# Altium schematic sheet ESP32_Korvo2.SchDoc
size D; SheetNumber: 3; SheetTotal: 3
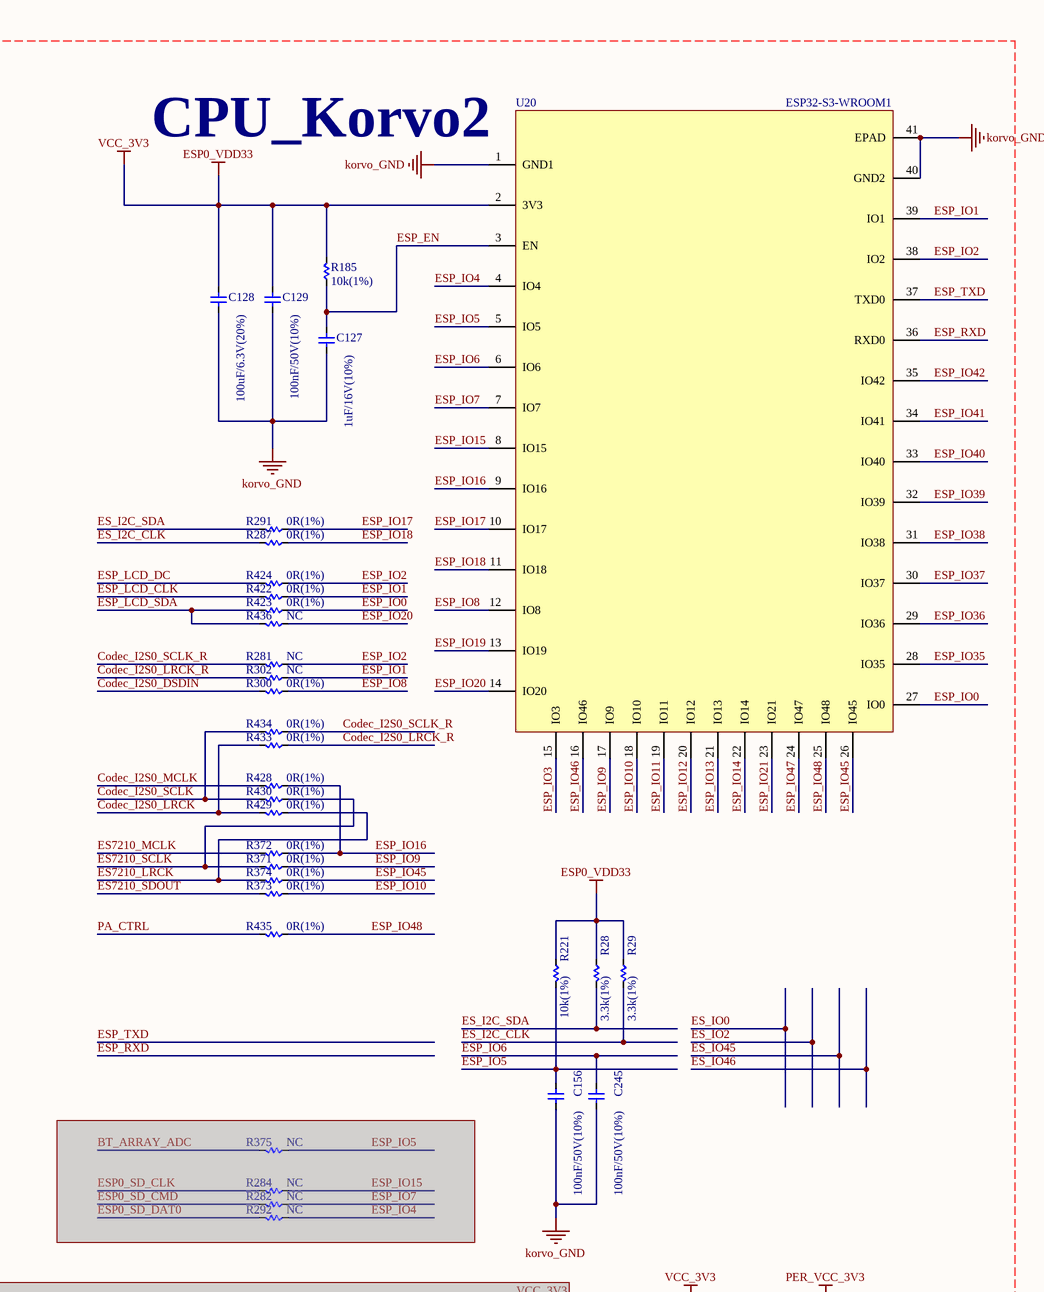
[diagram p0: ESP32_Korvo2.SchDoc, top left]
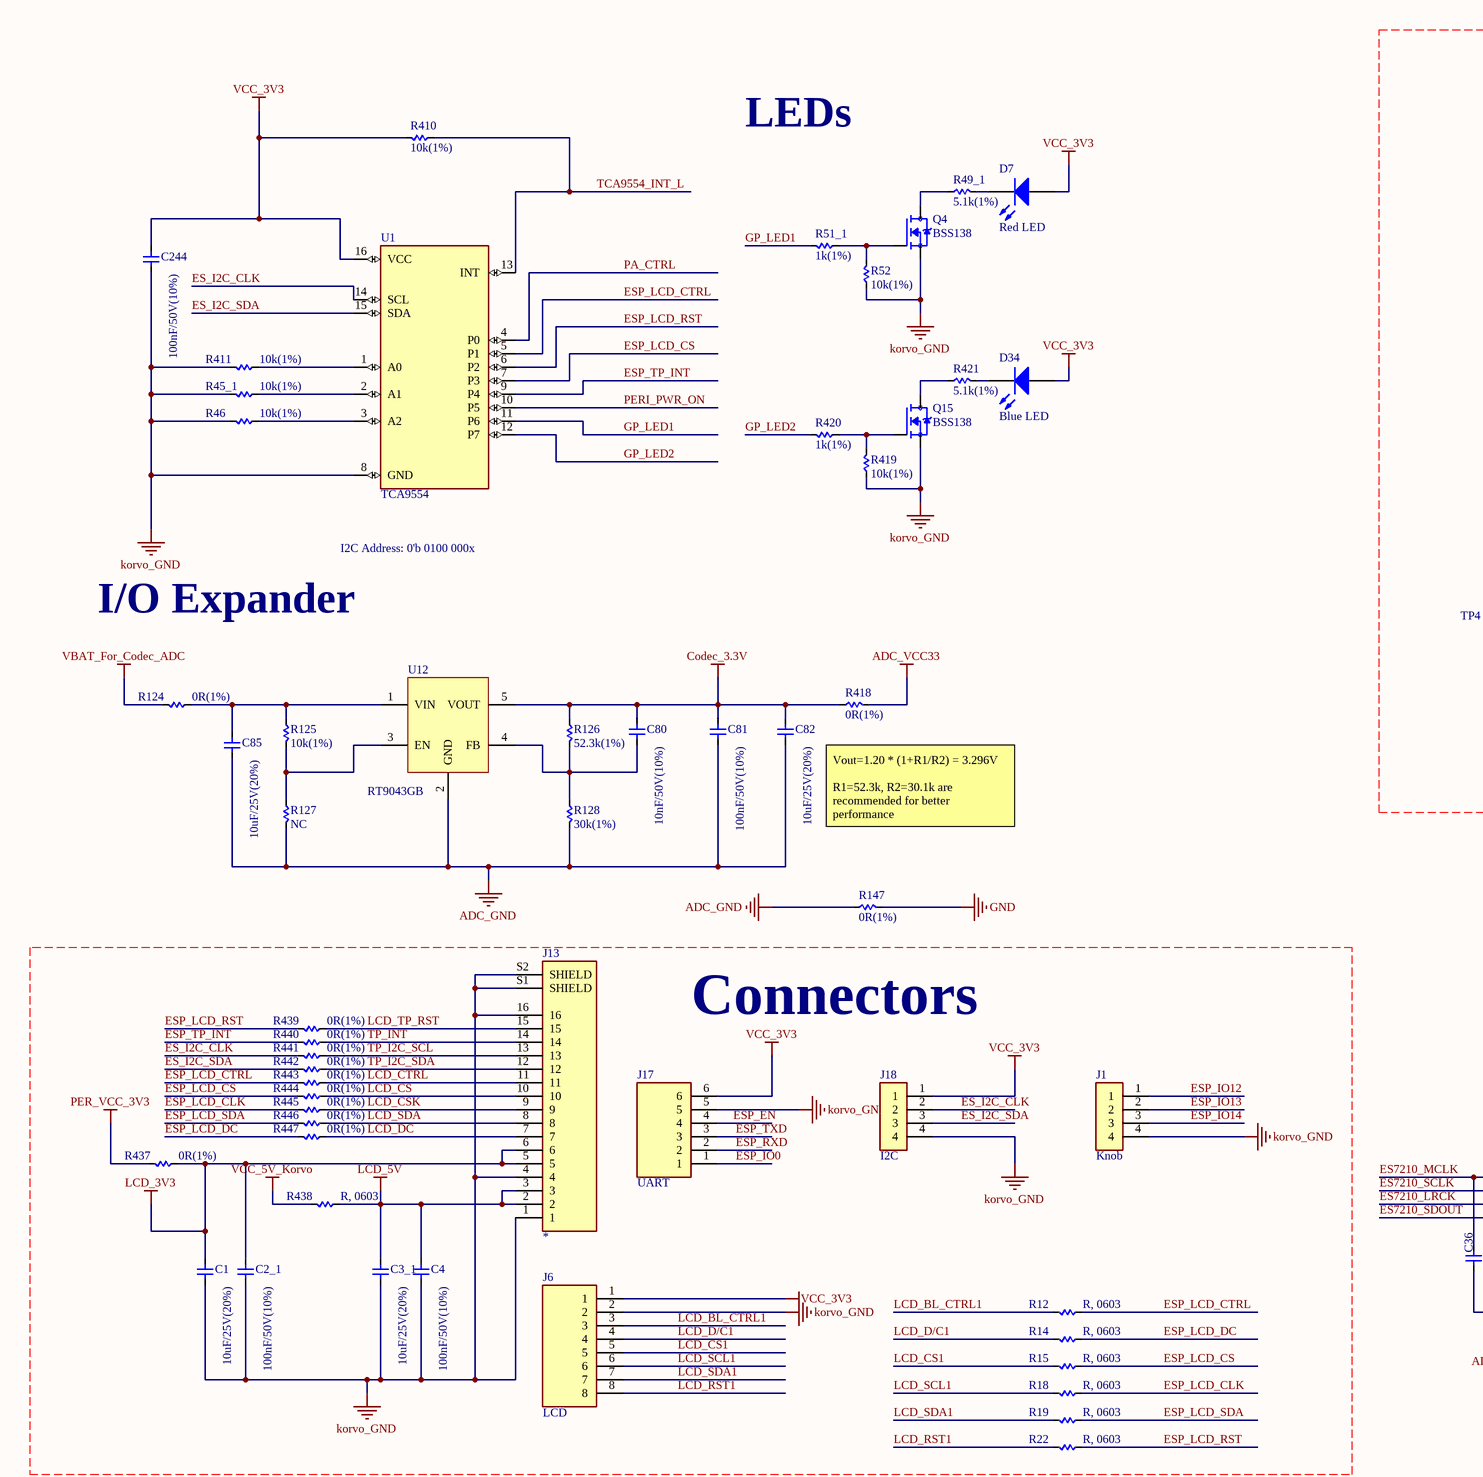
[diagram p1: ESP32_Korvo2.SchDoc, top middle]
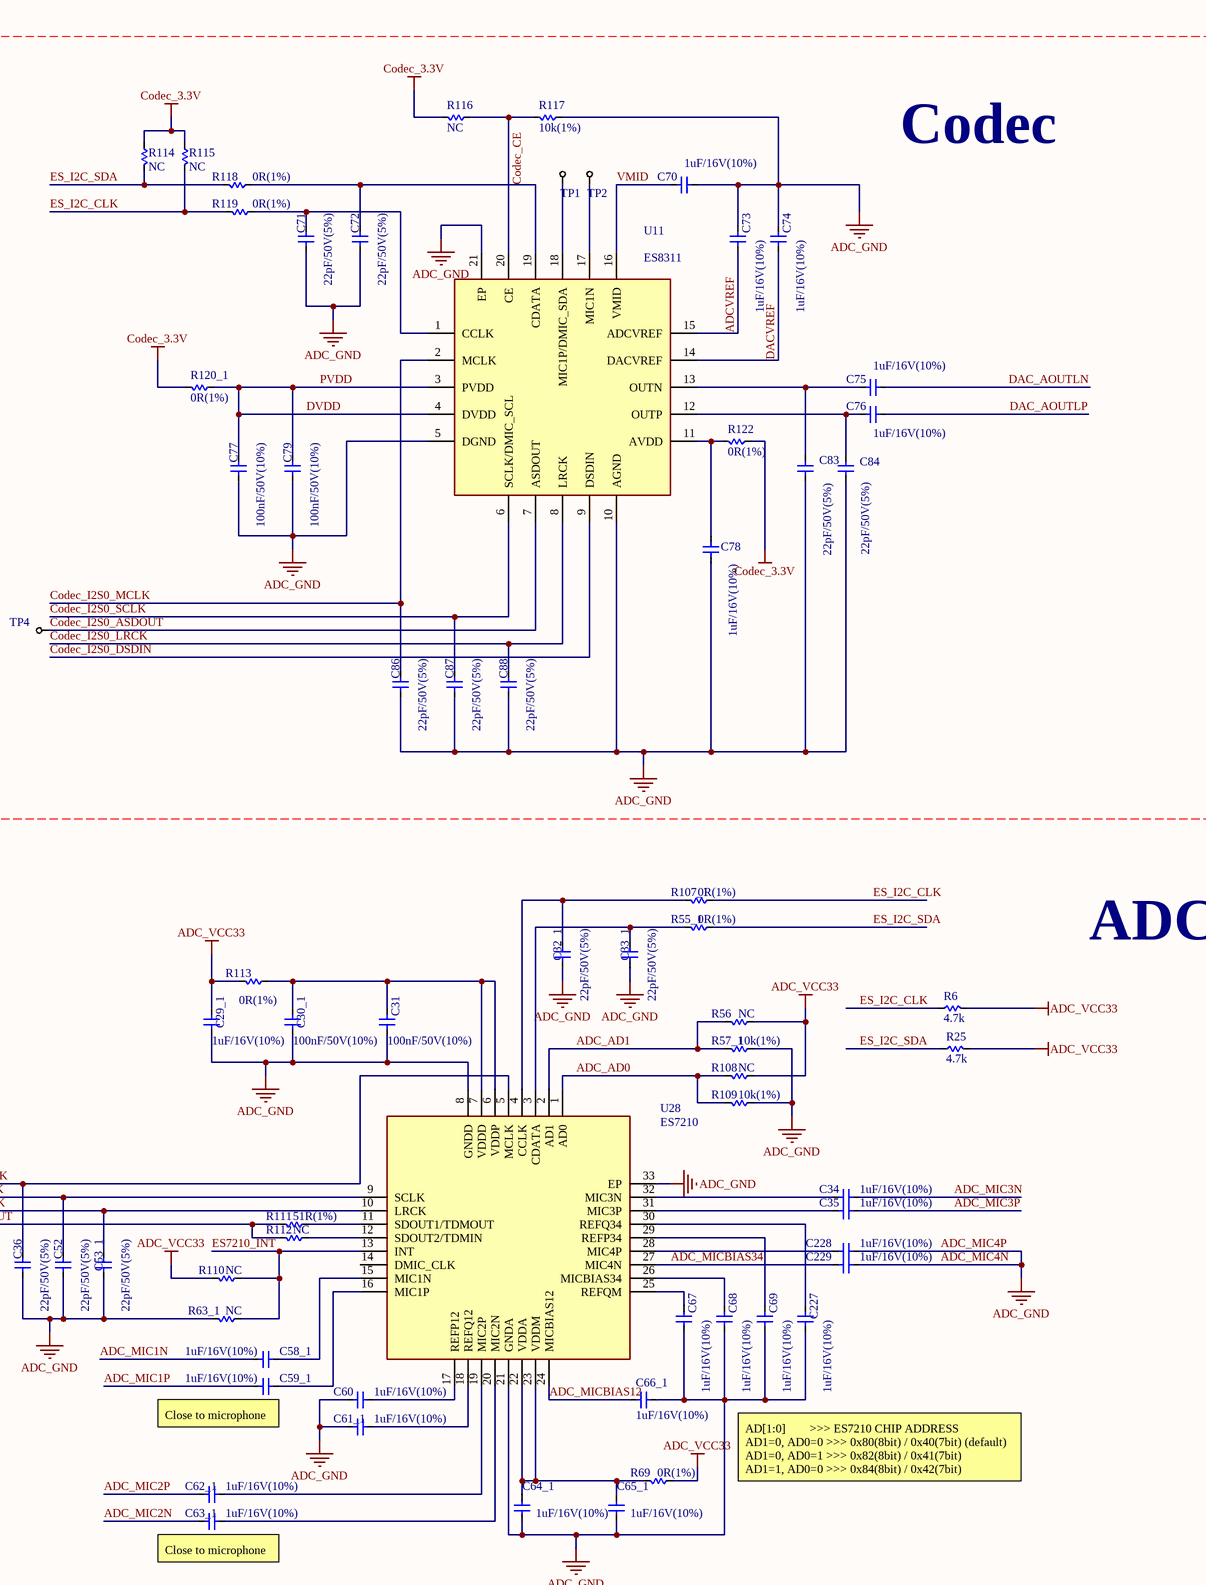
[diagram p2: ESP32_Korvo2.SchDoc, top right]
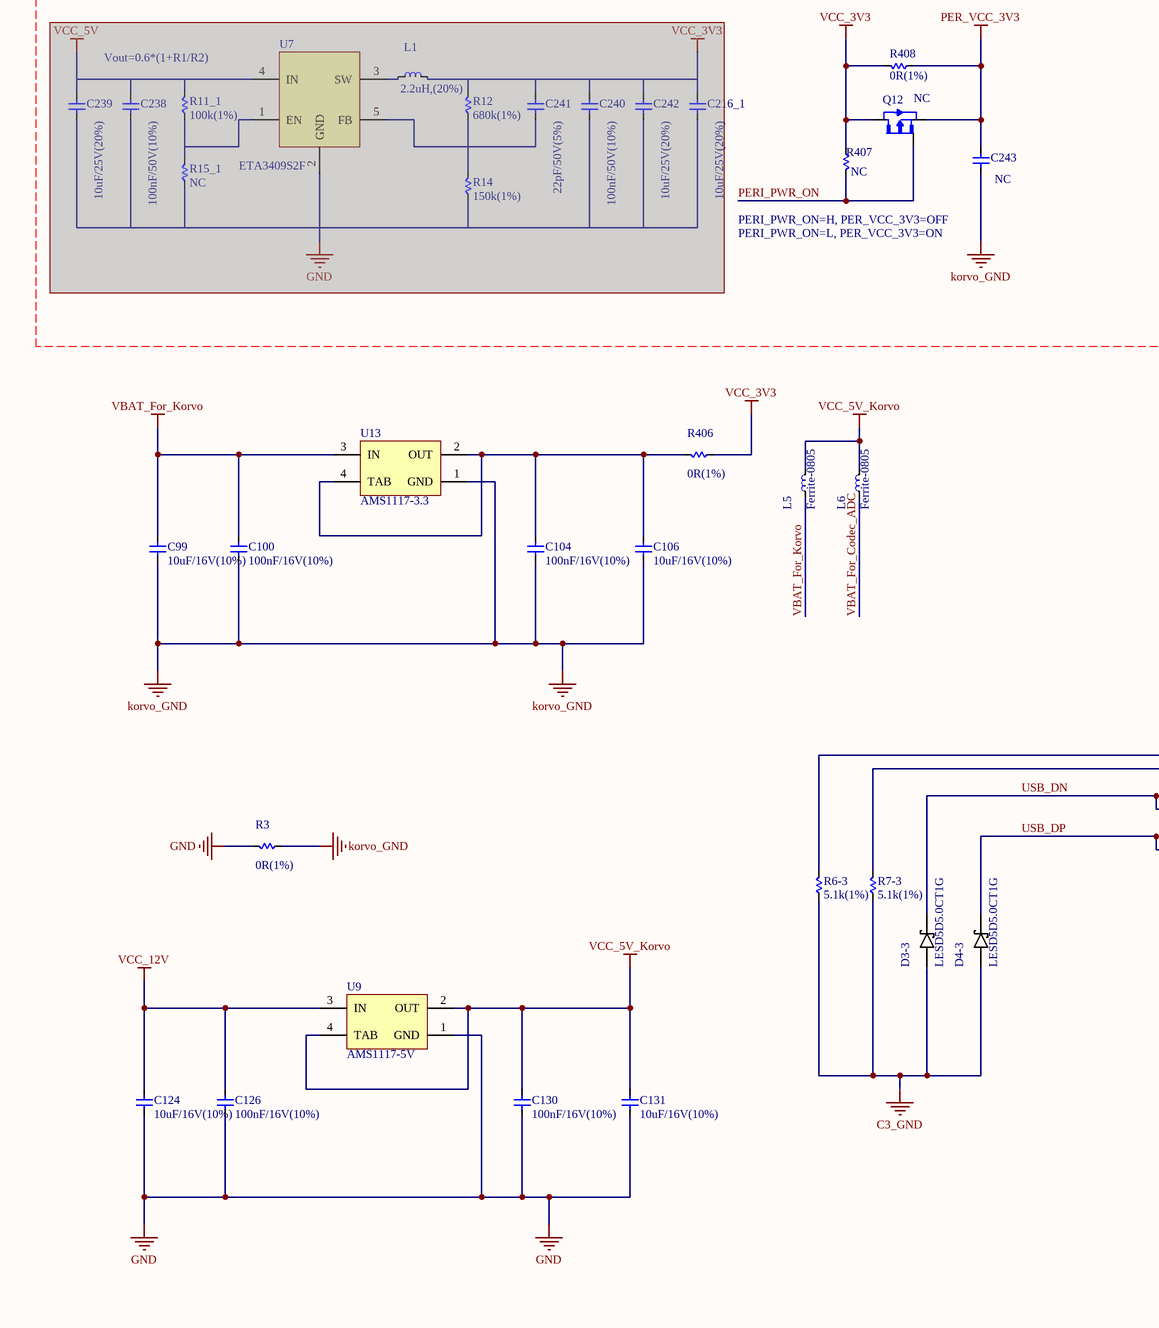
[diagram p3: ESP32_Korvo2.SchDoc, bottom left]
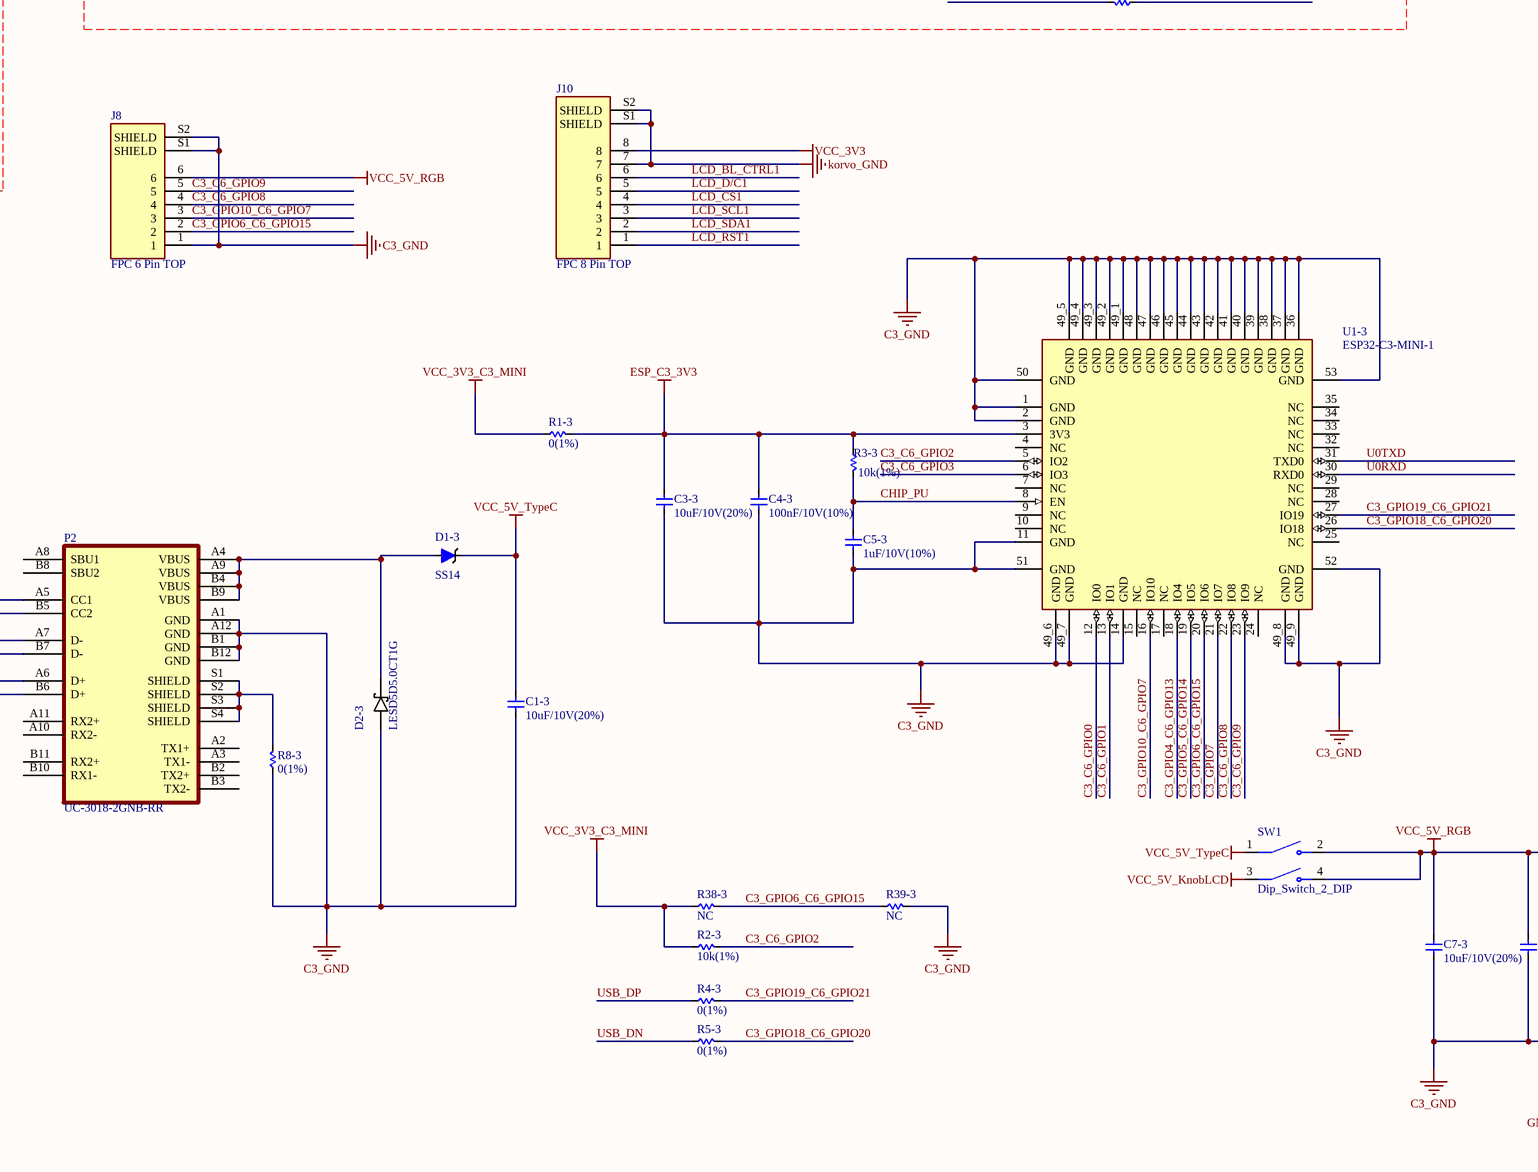
[diagram p4: ESP32_Korvo2.SchDoc, bottom middle]
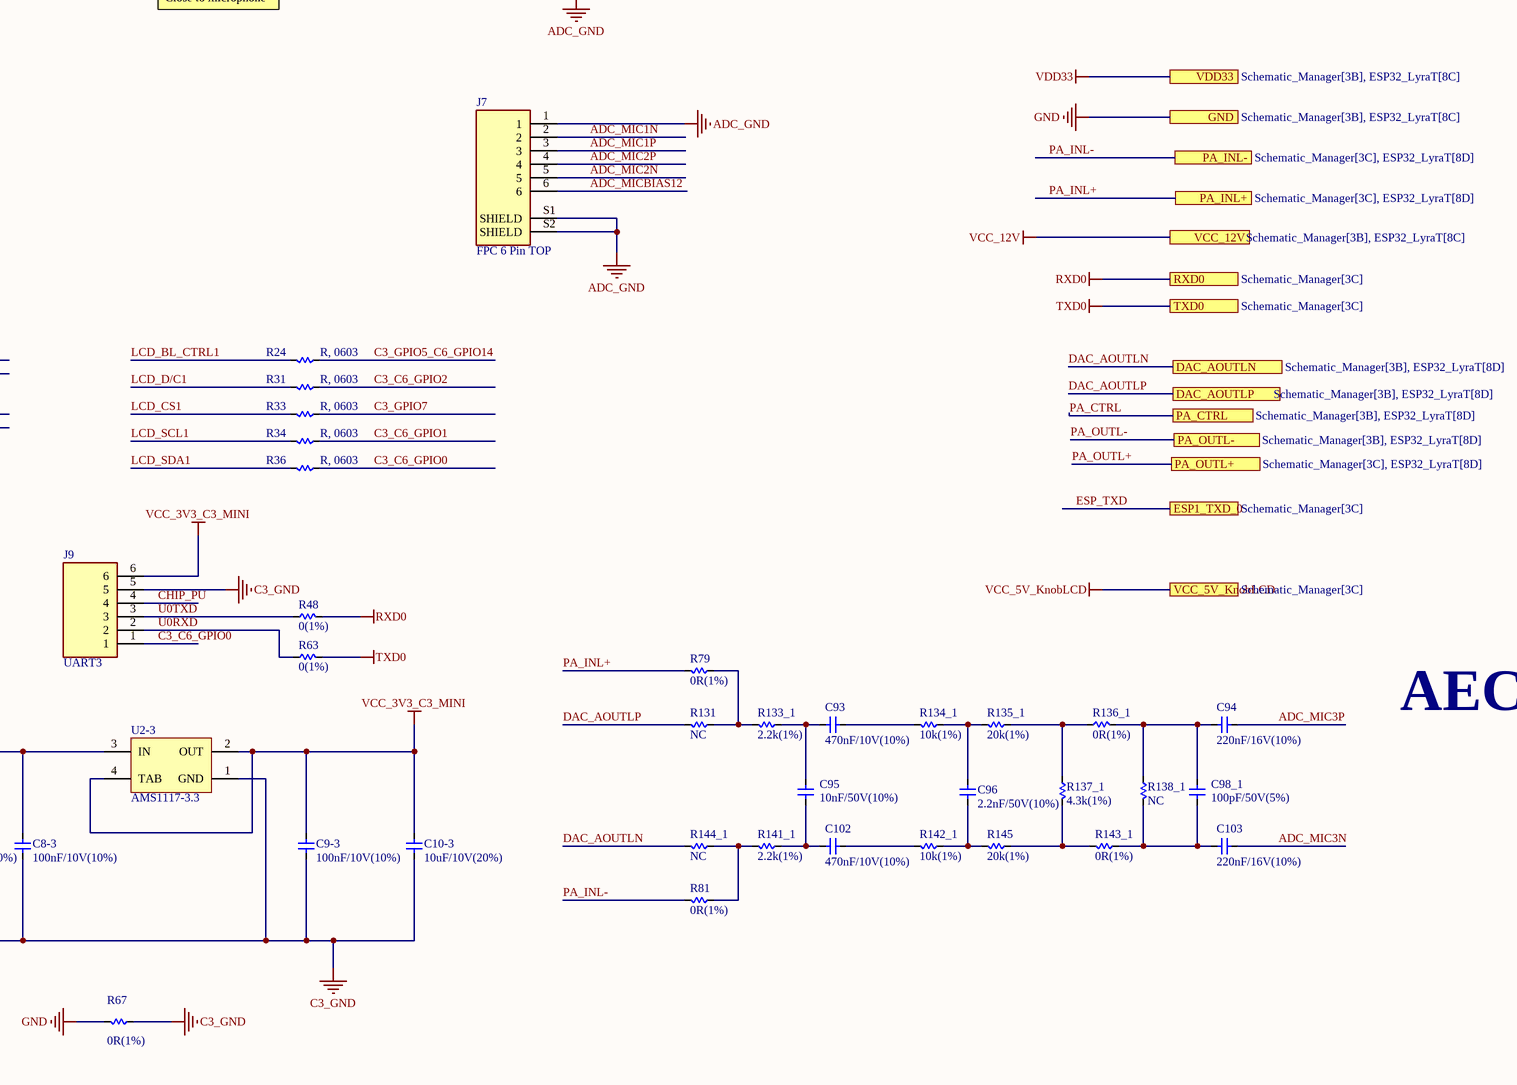
[diagram p5: ESP32_Korvo2.SchDoc, bottom right]

## Parts
(Parts that share a designator on the sheet are numbered #1, #2 ... from top to bottom, then left to right.)
C1  10uF/25V(20%)  [cap0603]
C1-3  10uF/10V(20%)  [cap0603]
C2_1  100nF/50V(10%)  [cap0603]
C3-3  10uF/10V(20%)  [cap0603]
C3_1  10uF/25V(20%)  [cap0603]
C4  100nF/50V(10%)  [cap0603]
C4-3  100nF/10V(10%)  [cap0603]
C5-3  1uF/10V(10%)  [cap0603]
C7-3  10uF/10V(20%)  [cap0603]
C8-3  100nF/10V(10%)  [cap0603]
C9-3  100nF/10V(10%)  [cap0603]
C10-3  10uF/10V(20%)  [cap0603]
C29_1  1uF/16V(10%)  [cap0603]
C30_1  100nF/50V(10%)  [cap0603]
C31  100nF/50V(10%)  [cap0603]
C32_1  22pF/50V(5%)  [cap0603]
C33_1  22pF/50V(5%)  [cap0603]
C34  1uF/16V(10%)  [cap0603]
C35  1uF/16V(10%)  [cap0603]
C36  22pF/50V(5%)  [cap0603]
C52  22pF/50V(5%)  [cap0603]
C53_1  22pF/50V(5%)  [cap0603]
C58_1  1uF/16V(10%)  [cap0603]
C59_1  1uF/16V(10%)  [cap0603]
C60  1uF/16V(10%)  [cap0603]
C61_1  1uF/16V(10%)  [cap0603]
C62_1  1uF/16V(10%)  [cap0603]
C63_1  1uF/16V(10%)  [cap0603]
C64_1  1uF/16V(10%)  [cap0603]
C65_1  1uF/16V(10%)  [cap0603]
C66_1  1uF/16V(10%)  [cap0603]
C67  1uF/16V(10%)  [cap0603]
C68  1uF/16V(10%)  [cap0603]
C69  1uF/16V(10%)  [cap0603]
C70  1uF/16V(10%)  [cap0603]
C71  22pF/50V(5%)  [cap0603]
C72  22pF/50V(5%)  [cap0603]
C73  1uF/16V(10%)  [cap0603]
C74  1uF/16V(10%)  [cap0603]
C75  1uF/16V(10%)  [cap0603]
C76  1uF/16V(10%)  [cap0603]
C77  100nF/50V(10%)  [cap0603]
C78  1uF/16V(10%)  [cap0603]
C79  100nF/50V(10%)  [cap0603]
C80  10nF/50V(10%)  [cap0603]
C81  100nF/50V(10%)  [cap0603]
C82  10uF/25V(20%)  [cap0603]
C83  22pF/50V(5%)  [cap0603]
C84  22pF/50V(5%)  [cap0603]
C85  10uF/25V(20%)  [cap0603]
C86  22pF/50V(5%)  [cap0603]
C87  22pF/50V(5%)  [cap0603]
C88  22pF/50V(5%)  [cap0603]
C93  470nF/10V(10%)  [cap0603]
C94  220nF/16V(10%)  [cap0603]
C95  10nF/50V(10%)  [cap0603]
C96  2.2nF/50V(10%)  [cap0603]
C98_1  100pF/50V(5%)  [cap0603]
C99  10uF/16V(10%)  [cap0603]
C100  100nF/16V(10%)  [cap0603]
C102  470nF/10V(10%)  [cap0603]
C103  220nF/16V(10%)  [cap0603]
C104  100nF/16V(10%)  [cap0603]
C106  10uF/16V(10%)  [cap0603]
C124  10uF/16V(10%)  [cap0603]
C126  100nF/16V(10%)  [cap0603]
C127  1uF/16V(10%)  [cap0603]
C128  100uF/6.3V(20%)  [CAP 1206]
C129  100nF/50V(10%)  [cap0603]
C130  100nF/16V(10%)  [cap0603]
C131  10uF/16V(10%)  [cap0603]
C156  100nF/50V(10%)  [cap0603]
C216_1  10uF/25V(20%)  [0805C]  (masked out: inside a compile mask, not in the netlist)
C227  1uF/16V(10%)  [cap0603]
C228  1uF/16V(10%)  [cap0603]
C229  1uF/16V(10%)  [cap0603]
C238  100nF/50V(10%)  [cap0603]  (masked out: inside a compile mask, not in the netlist)
C239  10uF/25V(20%)  [0805C]  (masked out: inside a compile mask, not in the netlist)
C240  100nF/50V(10%)  [cap0603]  (masked out: inside a compile mask, not in the netlist)
C241  22pF/50V(5%)  [cap0603]  (masked out: inside a compile mask, not in the netlist)
C242  10uF/25V(20%)  [0805C]  (masked out: inside a compile mask, not in the netlist)
C243  NC  [0805C]
C244  100nF/50V(10%)  [cap0603]
C245  100nF/50V(10%)  [cap0603]
D1-3  SS14  [DO-214AC]
D2-3  LESD5D5.0CT1G  [SOD-523]
D3-3  LESD5D5.0CT1G  [SOD-523]
D4-3  LESD5D5.0CT1G  [SOD-523]
D7  Red LED  [LED-0603-BLUE]
D34  Blue LED  [LED-0603-BLUE]
J1  Knob  [pin header1*4 - PH]
J6  LCD  [pin header1*8 - PH]
J7  FPC 6 Pin TOP  [FPC 6 PIN TOP]
J8  FPC 6 Pin TOP  [FPC 6 PIN TOP]
J9  UART3  [pin header1*6 - PH]
J10  FPC 8 Pin TOP  [FPC 8 Pin TOP]
J13  *  [FPC 16 PIN TOP]
J17  UART  [pin header1*6 - PH]
J18  I2C  [pin header1*4 - PH]
L1  2.2uH,(20%)  [Inductor 8*7]  (masked out: inside a compile mask, not in the netlist)
L5  Ferrite-0805  [Ferrite-0805]
L6  Ferrite-0805  [Ferrite-0805]
P2  UC-3018-2GNB-RR  [USB-typeC-Vertical]
Q4  BSS138  [SOT23-BSS138]
Q12  NC  [SOT23-3]
Q15  BSS138  [SOT23-BSS138]
R1-3  0(1%)  [R0603]
R2-3  10k(1%)  [R0603]
R3  0R(1%)  [RES-1206]
R3-3  10k(1%)  [R0603]
R4-3  0(1%)  [R0603]
R5-3  0(1%)  [R0603]
R6  4.7k  [RES-0603]
R6-3  5.1k(1%)  [R0603]
R7-3  5.1k(1%)  [R0603]
R8-3  0(1%)  [R0603]
R11_1  100k(1%)  [R0603]  (masked out: inside a compile mask, not in the netlist)
R12#1  R, 0603  [R0603]
R12#2  680k(1%)  [R0603]  (masked out: inside a compile mask, not in the netlist)
R14#1  R, 0603  [R0603]
R14#2  150k(1%)  [R0603]  (masked out: inside a compile mask, not in the netlist)
R15  R, 0603  [R0603]
R15_1  NC  [R0603]  (masked out: inside a compile mask, not in the netlist)
R18  R, 0603  [R0603]
R19  R, 0603  [R0603]
R22  R, 0603  [R0603]
R24  R, 0603  [R0603]
R25  4.7k  [RES-0603]
R28  3.3k(1%)  [R0603]
R29  3.3k(1%)  [R0603]
R31  R, 0603  [R0603]
R33  R, 0603  [R0603]
R34  R, 0603  [R0603]
R36  R, 0603  [R0603]
R38-3  NC  [R0603]
R39-3  NC  [R0603]
R45_1  10k(1%)  [R0603]
R46  10k(1%)  [R0603]
R48  0(1%)  [R0603]
R49_1  5.1k(1%)  [R0603]
R51_1  1k(1%)  [R0603]
R52  10k(1%)  [R0603]
R55_1  0R(1%)  [R0603]
R56  NC  [R0603]
R57_1  10k(1%)  [R0603]
R63  0(1%)  [R0603]
R63_1  NC  [R0603]
R67  0R(1%)  [RES-1206]
R69  0R(1%)  [R0603]
R79  0R(1%)  [R0603]
R81  0R(1%)  [R0603]
R107_1  0R(1%)  [R0603]
R108  NC  [R0603]
R109  10k(1%)  [R0603]
R110  NC  [R0603]
R111  51R(1%)  [R0603]
R112  NC  [R0603]
R113  0R(1%)  [R0603]
R114  NC  [R0603]
R115  NC  [R0603]
R116  NC  [R0603]
R117  10k(1%)  [R0603]
R118  0R(1%)  [R0603]
R119  0R(1%)  [R0603]
R120_1  0R(1%)  [R0603]
R122  0R(1%)  [R0603]
R124  0R(1%)  [RES-0805]
R125  10k(1%)  [R0603]
R126  52.3k(1%)  [R0603]
R127  NC  [R0603]
R128  30k(1%)  [R0603]
R131  NC  [R0603]
R133_1  2.2k(1%)  [R0603]
R134_1  10k(1%)  [R0603]
R135_1  20k(1%)  [R0603]
R136_1  0R(1%)  [R0603]
R137_1  4.3k(1%)  [R0603]
R138_1  NC  [R0603]
R141_1  2.2k(1%)  [R0603]
R142_1  10k(1%)  [R0603]
R143_1  0R(1%)  [R0603]
R144_1  NC  [R0603]
R145  20k(1%)  [R0603]
R147  0R(1%)  [RES-0805]
R185  10k(1%)  [R0603]
R221  10k(1%)  [R0603]
R281  NC  [R0603]
R282  NC  [RES-0603]  (masked out: inside a compile mask, not in the netlist)
R284  NC  [RES-0603]  (masked out: inside a compile mask, not in the netlist)
R287  0R(1%)  [R0603]
R291  0R(1%)  [R0603]
R292  NC  [RES-0603]  (masked out: inside a compile mask, not in the netlist)
R300  0R(1%)  [R0603]
R302  NC  [R0603]
R371  0R(1%)  [R0603]
R372  0R(1%)  [R0603]
R373  0R(1%)  [R0603]
R374  0R(1%)  [R0603]
R375  NC  [RES-0603]  (masked out: inside a compile mask, not in the netlist)
R406  0R(1%)  [RES-0805]
R407  NC  [R0603]
R408  0R(1%)  [R0603]
R410  10k(1%)  [R0603]
R411  10k(1%)  [R0603]
R418  0R(1%)  [RES-0805]
R419  10k(1%)  [R0603]
R420  1k(1%)  [R0603]
R421  5.1k(1%)  [R0603]
R422  0R(1%)  [R0603]
R423  0R(1%)  [R0603]
R424  0R(1%)  [R0603]
R428  0R(1%)  [R0603]
R429  0R(1%)  [R0603]
R430  0R(1%)  [R0603]
R433  0R(1%)  [R0603]
R434  0R(1%)  [R0603]
R435  0R(1%)  [R0603]
R436  NC  [R0603]
R437  0R(1%)  [R0603]
R438  R, 0603  [R0603]
R439  0R(1%)  [R0603]
R440  0R(1%)  [R0603]
R441  0R(1%)  [R0603]
R442  0R(1%)  [R0603]
R443  0R(1%)  [R0603]
R444  0R(1%)  [R0603]
R445  0R(1%)  [R0603]
R446  0R(1%)  [R0603]
R447  0R(1%)  [R0603]
SW1  Dip_Switch_2_DIP  [Dip_Switch_2_DIP]
TP1  Test Point  [Test Point SMD]  (value not drawn)
TP2  Test Point  [Test Point SMD]  (value not drawn)
TP4  Test Point  [Test Point SMD]  (value not drawn)
U1  TCA9554  [TCA9554]
U1-3  ESP32-C3-MINI-1  [ESP32-C3-MINI-1-N4]
U2-3  AMS1117-3.3  [SOT223]
U7  ETA3409S2F  [SOT-23-5]  (masked out: inside a compile mask, not in the netlist)
U9  AMS1117-5V  [SOT223]
U11  ES8311  [ES8311]
U12  RT9043GB  [SOT-23-5]
U13  AMS1117-3.3  [SOT223]
U20  ESP32-S3-WROOM1  [ESP32-S3-WROOM1N16R8]
U28  ES7210  [ES7210]

## Ports
DAC_AOUTLN (see Schematic_Manager[3B], ESP32_LyraT[8D]), DAC_AOUTLP (see Schematic_Manager[3B], ESP32_LyraT[8D]), ESP1_TXD_0 (see Schematic_Manager[3C]), GND (see Schematic_Manager[3B], ESP32_LyraT[8C]), PA_CTRL (see Schematic_Manager[3B], ESP32_LyraT[8D]), PA_INL+ (see Schematic_Manager[3C], ESP32_LyraT[8D]), PA_INL- (see Schematic_Manager[3C], ESP32_LyraT[8D]), PA_OUTL+ (see Schematic_Manager[3C], ESP32_LyraT[8D]), PA_OUTL- (see Schematic_Manager[3B], ESP32_LyraT[8D]), RXD0 (see Schematic_Manager[3C]), TXD0 (see Schematic_Manager[3C]), VCC_5V_KnobLCD (see Schematic_Manager[3C]), VCC_12V (see Schematic_Manager[3B], ESP32_LyraT[8C]), VDD33 (see Schematic_Manager[3B], ESP32_LyraT[8C])

## Nets
ADC_MIC4N: C29_1.2 C30_1.2 C31.2 C32_1.2 C33_1.2 C36.2 C52.2 C53_1.2 C60.1 C61_1.1 C64_1.2 C65_1.2 C66_1.2 C67.2 C68.2 C69.2 C70.1 C71.2 C72.2 C73.1 C74.1 C77.2 C78.1 C79.2 C81.1 C82.1 C83.1 C84.1 C85.1 C86.2 C87.2 C88.2 C227.2 C228.2 C229.2 J7.1 J7.S1(SHIELD) J7.S2(SHIELD) R57_1.1 R63_1.2 R109.1 R117.1 R127.2 R128.2 R147.1 U11.5(DGND) U11.10(AGND) U11.21(EP) U12.2(GND) U28.8(GNDD) U28.21(GNDA) U28.33(EP)  [also labelled ADC_GND, ADC_MIC4P]
ADC_VCC33: C29_1.1 R6.2 R25.2 R56.1 R69.1 R108.1 R110.2 R113.2 R418.2
C3_GND: C1-3.1 C3-3.1 C4-3.1 C5-3.1 C7-3.1 C8-3.1 C9-3.1 C10-3.1 D2-3.1 D3-3.1 D4-3.1 J8.1 J8.S1(SHIELD) J8.S2(SHIELD) J9.5 P2.A1(GND) P2.A12(GND) P2.B1(GND) P2.B12(GND) R6-3.1 R7-3.1 R8-3.1 R39-3.2 R67.1 U1-3.1(GND) U1-3.2(GND) U1-3.11(GND) U1-3.14(GND) U1-3.36(GND) U1-3.37(GND) U1-3.38(GND) U1-3.39(GND) U1-3.40(GND) U1-3.41(GND) U1-3.42(GND) U1-3.43(GND) U1-3.44(GND) U1-3.45(GND) U1-3.46(GND) U1-3.47(GND) U1-3.48(GND) U1-3.49_1(GND) U1-3.49_2(GND) U1-3.49_3(GND) U1-3.49_4(GND) U1-3.49_5(GND) U1-3.49_6(GND) U1-3.49_7(GND) U1-3.49_8(GND) U1-3.49_9(GND) U1-3.50(GND) U1-3.51(GND) U1-3.52(GND) U1-3.53(GND) U2-3.1(GND)
Codec_3.3V: C80.2 C81.2 C82.2 R114.1 R115.1 R116.2 R120_1.2 R122.1 R126.1 R418.1 U12.5(VOUT)
ESP0_VDD33: C128.2 C129.1 C244.2 D7.A D34.A J6.1 J10.8 J17.6 J18.1 Q12.3(D) R28.1 R29.1 R185.2 R221.1 R406.1 R407.1 R408.2 R410.2 U1.16(VCC) U20.2(3V3)  [also labelled VCC_3V3]
ESP_C3_3V3: C3-3.2 C4-3.2 R1-3.2 R3-3.1 U1-3.3(3V3)
GND: C124.1 C126.1 C130.1 C131.1 R3.2 R67.2 R147.2 U9.1(GND) ; port GND
korvo_GND: C1.1 C2_1.1 C3_1.1 C4.2 C99.1 C100.1 C104.1 C106.1 C127.1 C128.1 C129.2 C156.2 C243.1 C244.1 C245.2 J1.4 J6.2 J10.7 J10.S1(SHIELD) J10.S2(SHIELD) J13.1 J13.4 J13.16 J13.S1(SHIELD) J13.S2(SHIELD) J17.5 J18.4 Q4.2(S) Q15.2(S) R3.1 R45_1.2 R46.2 R52.1 R411.2 R419.1 U1.8(GND) U13.1(GND) U20.1(GND1) U20.40(GND2) U20.41(EPAD)
LCD_3V3: C1.2 C2_1.2 J13.5 J13.6 R437.1
LCD_5V: C3_1.2 C4.1 J13.2 J13.3 R438.1
PER_VCC_3V3: C243.2 Q12.2(S) R408.1 R437.2
RXD0: R48.2 ; port RXD0
TXD0: R63.2 ; port TXD0
VBAT_For_Codec_ADC: L6.2 R124.2
VBAT_For_Korvo: C99.2 C100.2 L5.2 U13.3(IN)
VCC_3V3_C3_MINI: C9-3.2 C10-3.2 J9.6 R1-3.1 R2-3.1 R38-3.1 U2-3.2(OUT) U2-3.4(TAB)
VCC_5V_KnobLCD: SW1.3 ; port VCC_5V_KnobLCD
VCC_5V_Korvo: C130.2 C131.2 L5.1 L6.1 R438.2 U9.2(OUT) U9.4(TAB)
VCC_5V_RGB: C7-3.2 C8-3.2 J8.6 SW1.2 SW1.4 U2-3.3(IN)
VCC_5V_TypeC: C1-3.2 D1-3.K SW1.1
VCC_12V: C124.2 C126.2 U9.3(IN) ; port VCC_12V
VDD33: port VDD33
ADC_AD0: R108.2 R109.2 U28.1(AD0)
ADC_AD1: R56.2 R57_1.2 U28.2(AD1)
ADC_MIC1N: C58_1.1 J7.2
ADC_MIC1P: C59_1.1 J7.3
ADC_MIC2N: C63_1.1 J7.5
ADC_MIC2P: C62_1.1 J7.4
ADC_MIC3N: C34.2 C103.2
ADC_MIC3P: C35.2 C94.2
ADC_MICBIAS12: C66_1.1 J7.6 U28.24(MICBIAS12)
ADC_MICBIAS34: C229.1 U28.27(MIC4N)
ADCVREF: C73.2 U11.15(ADCVREF)
C3_C6_GPIO0: J9.1 R36.1 U1-3.12(IO0)
C3_C6_GPIO1: R34.1 U1-3.13(IO1)
C3_C6_GPIO2: R2-3.2 R31.1 U1-3.5(IO2)
C3_C6_GPIO3: U1-3.6(IO3)
C3_C6_GPIO8: J8.4 U1-3.22(IO8)
C3_C6_GPIO9: J8.5 U1-3.23(IO9)
C3_GPIO4_C6_GPIO13: U1-3.18(IO4)
C3_GPIO5_C6_GPIO14: R24.1 U1-3.19(IO5)
C3_GPIO6_C6_GPIO15: J8.2 R38-3.2 R39-3.1 U1-3.20(IO6)
C3_GPIO7: R33.1 U1-3.21(IO7)
C3_GPIO10_C6_GPIO7: J8.3 U1-3.16(IO10)
C3_GPIO18_C6_GPIO20: R5-3.2 U1-3.26(IO18)
C3_GPIO19_C6_GPIO21: R4-3.2 U1-3.27(IO19)
CHIP_PU: C5-3.2 J9.4 R3-3.2 U1-3.8(EN)
Codec_CE: R116.1 R117.2 U11.20(CE)
Codec_I2S0_ASDOUT: TP4.1(T) U11.7(ASDOUT)
Codec_I2S0_DSDIN: R300.2 U11.9(DSDIN)
Codec_I2S0_LRCK: C88.1 R429.2 R433.2 U11.8(LRCK)
Codec_I2S0_LRCK_R: R302.2 R433.1
Codec_I2S0_MCLK: C86.1 R428.2 U11.2(MCLK)
Codec_I2S0_SCLK: C87.1 R430.2 R434.2 U11.6(SCLK/DMIC_SCL)
Codec_I2S0_SCLK_R: R281.2 R434.1
DAC_AOUTLN: C75.1 R144_1.2 ; port DAC_AOUTLN
DAC_AOUTLP: C76.1 R131.2 ; port DAC_AOUTLP
DACVREF: C74.2 U11.14(DACVREF)
DVDD: C77.1 C79.1 R120_1.1 U11.3(PVDD) U11.4(DVDD)  [also labelled PVDD]
ES7210_INT: R63_1.1 R110.1 U28.13(INT)
ES7210_LRCK: C53_1.1 R374.2 R429.1 U28.10(LRCK)
ES7210_MCLK: C36.1 R372.2 U28.5(MCLK)
ES7210_SCLK: C52.1 R371.2 R430.1 U28.9(SCLK)
ES7210_SDOUT: R111.2 R112.2 R373.2
ES_I2C_CLK: J18.2 R6.1 R29.2 R107_1.1 R115.2 R119.2 R287.2 R441.2 U1.14(SCL)
ES_I2C_SDA: J18.3 R25.1 R28.2 R55_1.1 R114.2 R118.2 R291.2 R442.2 U1.15(SDA)
ESP_EN: C127.2 J17.4 R185.1 U20.3(EN)
ESP_IO0: J17.1 R423.1 U20.27(IO0)
ESP_IO1: R302.1 R422.1 U20.39(IO1)
ESP_IO2: R281.1 R424.1 U20.38(IO2)
ESP_IO3: U20.15(IO3)
ESP_IO4: U20.4(IO4)
ESP_IO5: C156.1 R221.2 U20.5(IO5)
ESP_IO6: C245.1 U20.6(IO6)
ESP_IO7: U20.7(IO7)
ESP_IO8: R300.1 U20.12(IO8)
ESP_IO9: R371.1 U20.17(IO9)
ESP_IO10: R373.1 U20.18(IO10)
ESP_IO11: U20.19(IO11)
ESP_IO12: J1.1 U20.20(IO12)
ESP_IO13: J1.2 U20.21(IO13)
ESP_IO14: J1.3 U20.22(IO14)
ESP_IO15: U20.8(IO15)
ESP_IO16: R372.1 R428.1 U20.9(IO16)
ESP_IO17: R291.1 U20.10(IO17)
ESP_IO18: R287.1 U20.11(IO18)
ESP_IO19: U20.13(IO19)
ESP_IO20: R436.1 U20.14(IO20)
ESP_IO21: U20.23(IO21)
ESP_IO35: U20.28(IO35)
ESP_IO36: U20.29(IO36)
ESP_IO37: U20.30(IO37)
ESP_IO38: U20.31(IO38)
ESP_IO39: U20.32(IO39)
ESP_IO40: U20.33(IO40)
ESP_IO41: U20.34(IO41)
ESP_IO42: U20.35(IO42)
ESP_IO45: R374.1 U20.26(IO45)
ESP_IO46: U20.16(IO46)
ESP_IO47: U20.24(IO47)
ESP_IO48: R435.1 U20.25(IO48)
ESP_LCD_CLK: R18.1 R422.2 R445.2
ESP_LCD_CS: R15.1 R444.2 U1.7(P3)
ESP_LCD_CTRL: R12#1.1 R443.2 U1.5(P1)
ESP_LCD_DC: R14#1.1 R424.2 R447.2
ESP_LCD_RST: R22.1 R439.2 U1.6(P2)
ESP_LCD_SDA: R19.1 R423.2 R436.2 R446.2
ESP_RXD: J17.2 U20.36(RXD0)
ESP_TP_INT: R440.2 U1.9(P4)
ESP_TXD: J17.3 U20.37(TXD0) ; port ESP1_TXD_0
GP_LED1: R51_1.2 U1.11(P6)
GP_LED2: R420.2 U1.12(P7)
LCD_BL_CTRL1: J6.3 J10.6 R12#1.2 R24.2
LCD_CS: J13.10 R444.1
LCD_CS1: J6.5 J10.4 R15.2 R33.2
LCD_CSK: J13.9 R445.1
LCD_CTRL: J13.11 R443.1
LCD_D/C1: J6.4 J10.5 R14#1.2 R31.2
LCD_DC: J13.7 R447.1
LCD_RST1: J6.8 J10.1 R22.2
LCD_SCL1: J6.6 J10.3 R18.2 R34.2
LCD_SDA: J13.8 R446.1
LCD_SDA1: J6.7 J10.2 R19.2 R36.2
LCD_TP_RST: J13.15 R439.1
PA_CTRL: R435.2 U1.4(P0) ; port PA_CTRL
PA_INL+: R79.2 ; port PA_INL+
PA_INL-: R81.2 ; port PA_INL-
PA_OUTL+: port PA_OUTL+
PA_OUTL-: port PA_OUTL-
PERI_PWR_ON: Q12.1(G) R407.2 U1.10(P5)
TCA9554_INT_L: R410.1 U1.13(INT)
TP_I2C_SCL: J13.13 R441.1
TP_I2C_SDA: J13.12 R442.1
TP_INT: J13.14 R440.1
U0RXD: J9.2 R63.1 U1-3.30(RXD0)
U0TXD: J9.3 R48.1 U1-3.31(TXD0)
USB_DN: D3-3.2 P2.A7(D-) P2.B7(D-) R5-3.1
USB_DP: D4-3.2 P2.A6(D+) P2.B6(D+) R4-3.1
VMID: C70.2 U11.16(VMID)
NetC30_1_1: C30_1.1 C31.1 R113.1 U28.6(VDDP) U28.7(VDDD)
NetC32_1_1: C32_1.1 R107_1.2 U28.4(CCLK)
NetC33_1_1: C33_1.1 R55_1.2 U28.3(CDATA)
NetC34_1: C34.1 U28.32(MIC3N)
NetC35_1: C35.1 U28.31(MIC3P)
NetC58_1_2: C58_1.2 U28.15(MIC1N)
NetC59_1_2: C59_1.2 U28.16(MIC1P)
NetC60_2: C60.2 U28.17(REFP12)
NetC61_1_2: C61_1.2 U28.18(REFQ12)
NetC62_1_2: C62_1.2 U28.19(MIC2P)
NetC63_1_2: C63_1.2 U28.20(MIC2N)
NetC64_1_1: C64_1.1 C65_1.1 R69.2 U28.22(VDDA) U28.23(VDDM)
NetC67_1: C67.1 U28.25(REFQM)
NetC68_1: C68.1 U28.26(MICBIAS34)
NetC69_1: C69.1 U28.29(REFP34)
NetC71_1: C71.1 R119.1 U11.1(CCLK)
NetC72_1: C72.1 R118.1 U11.19(CDATA)
NetC75_2: C75.2 C83.2 U11.13(OUTN)
NetC76_2: C76.2 C84.2 U11.12(OUTP)
NetC78_2: C78.2 R122.2 U11.11(AVDD)
NetC80_1: C80.1 R126.2 R128.1 U12.4(FB)
NetC85_2: C85.2 R124.1 R125.1 U12.1(VIN)
NetC93_1: C93.1 C95.1 R133_1.1
NetC93_2: C93.2 R134_1.2
NetC94_1: C94.1 C98_1.1 R136_1.2 R138_1.1
NetC95_2: C95.2 C102.1 R141_1.1
NetC96_1: C96.1 R142_1.1 R145.2
NetC96_2: C96.2 R134_1.1 R135_1.2
NetC98_1_2: C98_1.2 C103.1 R138_1.2 R143_1.1
NetC102_2: C102.2 R142_1.2
NetC104_2: C104.2 C106.2 R406.2 U13.2(OUT) U13.4(TAB)
NetC227_1: C227.1 U28.30(REFQ34)
NetC228_1: C228.1 U28.28(MIC4P)
NetD1-3_A: D1-3.A D2-3.2 P2.A4(VBUS) P2.A9(VBUS) P2.B4(VBUS) P2.B9(VBUS)
NetD7_K: D7.K R49_1.2
NetD34_K: D34.K R421.2
NetP2_A5: P2.A5(CC1) R6-3.2
NetP2_B5: P2.B5(CC2) R7-3.2
NetP2_S1: P2.S1(SHIELD) P2.S2(SHIELD) P2.S3(SHIELD) P2.S4(SHIELD) R8-3.2
NetQ4_1: Q4.1(G) R51_1.1 R52.2
NetQ4_3: Q4.3(D) R49_1.1
NetQ15_1: Q15.1(G) R419.2 R420.1
NetQ15_3: Q15.3(D) R421.1
NetR45_1_1: R45_1.1 U1.2(A1)
NetR46_1: R46.1 U1.3(A2)
NetR79_1: R79.1 R131.1 R133_1.2
NetR81_1: R81.1 R141_1.2 R144_1.1
NetR111_1: R111.1 U28.11(SDOUT1/TDMOUT)
NetR112_1: R112.1 U28.12(SDOUT2/TDMIN)
NetR125_2: R125.2 R127.1 U12.3(EN)
NetR135_1_1: R135_1.1 R136_1.1 R137_1.1
NetR137_1_2: R137_1.2 R143_1.2 R145.1
NetR411_1: R411.1 U1.1(A0)
NetTP1_1: TP1.1(T) U11.18(MIC1P/DMIC_SDA)
NetTP2_1: TP2.1(T) U11.17(MIC1N)

Not connected (* = marked no-connect by the designer): P2 A2(TX1+) A3(TX1-) A8(SBU1) A10(RX2-) A11(RX2+) B2(TX2+) B3(TX2-) B8(SBU2) B10(RX1-) B11(RX2+); U1-3 4(NC) 7(NC) 9(NC) 10(NC) 15(NC) 17(NC) 24(NC) 25(NC) 28(NC) 29(NC) 32(NC) 33(NC) 34(NC) 35(NC); U28 14(DMIC_CLK)

## Notes on the sheet
- LEDs
- CPU_Korvo2
- Codec
- I2C Address: 0'b 0100 000x
- I/O Expander
- Vout=1.20 * (1+R1/R2) = 3.296V
  R1=52.3k, R2=30.1k are recommended for better performance
- ADC
- Connectors
- Vout=0.6*(1+R1/R2)
- (near C59_1) Close to microphone
- AD[1:0]        >>> ES7210 CHIP ADDRESS
  AD1=0, AD0=0 >>> 0x80(8bit) / 0x40(7bit) (default)
  AD1=0, AD0=1 >>> 0x82(8bit) / 0x41(7bit)
  AD1=1, AD0=0 >>> 0x84(8bit) / 0x42(7bit)
  AD1=1, AD0=1 >>> 0x86(8bit) / 0x43(7bit)
- (near R407) PERI_PWR_ON=H, PER_VCC_3V3=OFF
- PERI_PWR_ON=L, PER_VCC_3V3=ON
- (near C63_1) Close to microphone
- AEC

## Library data of the parts
C1 C1-3 C2_1 C3-3 C3_1 C4 C4-3 C5-3 C7-3 C8-3 C9-3 C10-3 C29_1 C30_1 C31 C32_1 C33_1 C34-C36 C52 C53_1 C58_1 C59_1 C60 C61_1 C62_1 C63_1 C64_1 C65_1 C66_1 C67-C88 C93-C96 C98_1 C99 C100 C102-C104 C106 C124 C126-C131 C156 C216_1 C227-C229 C238-C242 C244 C245 = Cap 0603: Capacitor 0603; Published: 8-Jun-2000; LatestRevisionDate: 17-Jul-2002; LatestRevisionNote: Re-released for DXP Platform.; Publisher: Altium Limited
  C1 C3_1 C82 C85 C216_1 C239 C242: Value: 10uF/25V(20%)
  C1-3 C3-3 C7-3 C10-3: Value: 10uF/10V(20%)
  C2_1 C4 C30_1 C31 C77 C79 C81 C129 C156 C238 C240 C244 C245: Value: 100nF/50V(10%)
  C4-3 C8-3 C9-3: Value: 100nF/10V(10%)
  C5-3: Value: 1uF/10V(10%)
  C29_1 C34 C35 C58_1 C59_1 C60 C61_1 C62_1 C63_1 C64_1 C65_1 C66_1 C67-C70 C73-C76 C78 C127 C227-C229: Value: 1uF/16V(10%)
  C32_1 C33_1 C36 C52 C53_1 C71 C72 C83 C84 C86-C88 C241: Value: 22pF/50V(5%)
  C80 C95: Value: 10nF/50V(10%)
  C93 C102: Value: 470nF/10V(10%)
  C94 C103: Value: 220nF/16V(10%)
  C96: Value: 2.2nF/50V(10%)
  C98_1: Value: 100pF/50V(5%)
  C99 C106 C124 C131: Value: 10uF/16V(10%)
  C100 C104 C126 C130: Value: 100nF/16V(10%)
  C128: Value: 100uF/6.3V(20%)
C243 = Cap 0603: Capacitor 0603; Value: 10uF/25V(20%); Published: 8-Jun-2000; LatestRevisionDate: 17-Jul-2002; LatestRevisionNote: Re-released for DXP Platform.; Publisher: Altium Limited
D1-3 = 1N4007: Schottky Barrier Rectifier; MP: EDZV12B; MF: ROHM Semiconductor; Price: None; Package: None; SnapEDA_Link: https://www.snapeda.com/parts/EDZV12B/EMI/view-part/4479349/?ref=snap; Availability: Unavailable; Value: *
D2-3 D3-3 D4-3 = sh_diod: MF: ON Semiconductor; MP: SS34; Package: None; Price: None; Availability: Unavailable; SnapEDA_Link: https://www.snapeda.com/parts/SS34/ON%20Semiconductor/view-part/4479478/?ref=snap; Value: *
D7 D34 = LED1: Typical RED GaAs LED; Published: 8-Jun-2000; LatestRevisionDate: 08-Jul-2005; LatestRevisionNote: Mech Layer 1 removed.; PackageReference: LED-1; Publisher: Altium Limited; PackageDescription: LED; 2 Leads
J1 J18 = Con-B4B-XH-A: Connector Header Through Hole 4 position 0.098 _2.50mm_; MP: B4B-XH-A_LF__SN_; MF: JST Sales; Price: None; Package: None; Value: *; Availability: Unavailable; SnapEDA_Link: https://www.snapeda.com/parts/B4B-XH-A%28LF%29%28SN%29/JST%20Sales%20America%20Inc./view-part/447494/?ref=snap
J6 = Con-B8B-XH: Connector; Manufacturer_Name: JST (JAPAN SOLDERLESS TERMINALS); Manufacturer_Part_Number: B7B-XH-A(LF)(SN); Datasheet Link: http://www.jst-mfg.com/product/pdf/eng/eXH.pdf; Height: 7mm; Arrow Part Number: B7B-XH-A(LF)(SN); Arrow Price/Stock: https://www.arrow.com/en/products/b7b-xh-a-lf-sn/jst-manufacturing
J9 J17 = Con-B6B-XH-A_LF__SN_: Connector B6B-XH-A; Manufacturer_Name: JST Sales America; Manufacturer_Part_Number: B6B-XH-A(LF)(SN); Datasheet Link: https://datasheet.lcsc.com/szlcsc/JST-Sales-America-B6B-XH-A-LF-SN_C144397.pdf; Height: 7mm
J13 = FPC 16 Pin TOP
L1 = INDUCTOR 8*7: Inductor round 8*7; MP: DR127-330-R; MF: Eaton; Price: None; Package: Nonstandard Eaton; Availability: Unavailable; SnapEDA_Link: https://www.snapeda.com/parts/DR127-330-R/Eaton/view-part/?ref=snap; Value: *
L5 L6 = Ferrite _0805: 3A@120Ohm(25%), 25mOhm; MF: Murata; MP: BLM18BB331SN1D; Package: 0603 Murata; Price: None; Availability: Unavailable; SnapEDA_Link: https://www.snapeda.com/parts/BLM18BB331SN1D/Murata%20Electronics%20North%20America/view-part/?ref=snap; Value: *
P2 = UC-3018-2GNB-RR: Type-C
Q12 = AO3401: P-Channel 30V 4A _Ta_ 1.4W _Ta_ Surface Mount SOT-23-3; Value: AO3401A; MF: Alpha & Omega Semiconductor; MP: AO3401; SnapEDA_Link: https://www.snapeda.com/parts/AO3401/Alpha%20%26%20Omega%20Semiconductor/view-part/4592622/?ref=snap; Availability: Unavailable; Package: SOT-23-3 Alpha &amp; Omega Semiconductor; Price: None
R1-3 R2-3 R3 R3-3 R4-3 R5-3 R6-3 R7-3 R8-3 R11_1 R12#2 R14#2 R28 R29 R45_1 R46 R48 R49_1 R51_1 R52 R55_1 R57_1 R63 R67 R69 R79 R81 R107_1 R109 R111 R113 R117-R119 R120_1 R122 R124-R126 R128 R133_1 R134_1 R135_1 R136_1 R137_1 R141_1 R142_1 R143_1 R145 R147 R185 R221 R287 R291 R300 R371-R374 R406 R408 R410 R411 R418-R424 R428-R430 R433-R435 R437 R439-R447 = Res 1206: 10mohm 1% precision, temperature coefficient less than 100ppm; Published: 8-Jun-2000; LatestRevisionDate: 29-May-2009; LatestRevisionNote: IPC-7351 Footprint Added.; PackageReference: J1-0603; Publisher: Altium Limited; PackageDescription: Chip Resistor
  R1-3 R4-3 R5-3 R8-3 R48 R63: Value: 0(1%)
  R2-3 R3-3 R45_1 R46 R52 R57_1 R109 R117 R125 R134_1 R142_1 R185 R221 R410 R411 R419: Value: 10k(1%)
  R3 R55_1 R67 R69 R79 R81 R107_1 R113 R118 R119 R120_1 R122 R124 R136_1 R143_1 R147 R287 R291 R300 R371-R374 R406 R408 R418 R422-R424 R428-R430 R433-R435 R437 R439-R447: Value: 0R(1%)
  R6-3 R7-3 R49_1 R421: Value: 5.1k(1%)
  R11_1: Value: 100k(1%)
  R12#2: Value: 680k(1%)
  R14#2: Value: 150k(1%)
  R28 R29: Value: 3.3k(1%)
  R51_1 R420: Value: 1k(1%)
  R111: Value: 51R(1%)
  R126: Value: 52.3k(1%)
  R128: Value: 30k(1%)
  R133_1 R141_1: Value: 2.2k(1%)
  R135_1 R145: Value: 20k(1%)
  R137_1: Value: 4.3k(1%)
R6 R12#1 R14#1 R15 R18 R19 R22 R24 R25 R31 R33 R34 R36 R438 = Res 0603: Resistor 0603; Published: 8-Jun-2000; LatestRevisionDate: 29-May-2009; LatestRevisionNote: IPC-7351 Footprint Added.; PackageReference: J1-0603; Publisher: Altium Limited; PackageDescription: Chip Resistor
  R6 R25: Value: *
R15_1 = Res 1206: 10mohm 1% precision, temperature coefficient less than 100ppm; Value: 100k(1%); Published: 8-Jun-2000; LatestRevisionDate: 29-May-2009; LatestRevisionNote: IPC-7351 Footprint Added.; PackageReference: J1-0603; Publisher: Altium Limited; PackageDescription: Chip Resistor
R38-3 R39-3 R56 R63_1 R108 R110 R116 R127 R407 = Res 1206: 10mohm 1% precision, temperature coefficient less than 100ppm; Value: 10k(1%); Published: 8-Jun-2000; LatestRevisionDate: 29-May-2009; LatestRevisionNote: IPC-7351 Footprint Added.; PackageReference: J1-0603; Publisher: Altium Limited; PackageDescription: Chip Resistor
R112 R131 R144_1 R281 R282 R284 R292 R302 R375 R436 = Res 1206: 10mohm 1% precision, temperature coefficient less than 100ppm; Value: 0R(1%); Published: 8-Jun-2000; LatestRevisionDate: 29-May-2009; LatestRevisionNote: IPC-7351 Footprint Added.; PackageReference: J1-0603; Publisher: Altium Limited; PackageDescription: Chip Resistor
R114 R115 = Res 1206: 10mohm 1% precision, temperature coefficient less than 100ppm; Value: 2k(1%); Published: 8-Jun-2000; LatestRevisionDate: 29-May-2009; LatestRevisionNote: IPC-7351 Footprint Added.; PackageReference: J1-0603; Publisher: Altium Limited; PackageDescription: Chip Resistor
R138_1 = Res 1206: 10mohm 1% precision, temperature coefficient less than 100ppm; Value: 3.3k(1%); Published: 8-Jun-2000; LatestRevisionDate: 29-May-2009; LatestRevisionNote: IPC-7351 Footprint Added.; PackageReference: J1-0603; Publisher: Altium Limited; PackageDescription: Chip Resistor
U1 = TCA9554: 8-bit 1.65- to 5.5-V I2C/SMBus I/O expander with interrupt, weak pull-up & config registers; MP: TCA9554ADBQR; MF: Texas Instruments; Purchase-URL: https://pricing.snapeda.com/search/part/TCA9554ADBQR/?ref=eda; Digi-Key_Part_Number: 296-42162-2-ND; SnapEDA_Link: https://www.snapeda.com/parts/TCA9554ADBQR/Texas+Instruments/view-part/?ref=snap; Package: SSOP-16 Texas Instruments; Value: *; Check_prices: https://www.snapeda.com/parts/TCA9554ADBQR/Texas+Instruments/view-part/?ref=eda
U2-3 U9 U13 = AMS1117-x.x: x.x Volt, 800mA Low-Dropout Linear Regulator, 4-pin SOT-223; Designer: Ali Hafizi; Data: 16-12-2016
U7 = ETA3409S2F: 3MHz 1.5A/2A High ŋ Step-Down Converter in SOT23-5 Package
U11 = ES8311: Low Power Mono Audio CODEC
U12 = RT9043GB: High PSRR, Low Dropout, 400mA Adjustable LDO Regulator
U28 = ES7210: High Performance Four Channels Audio ADC